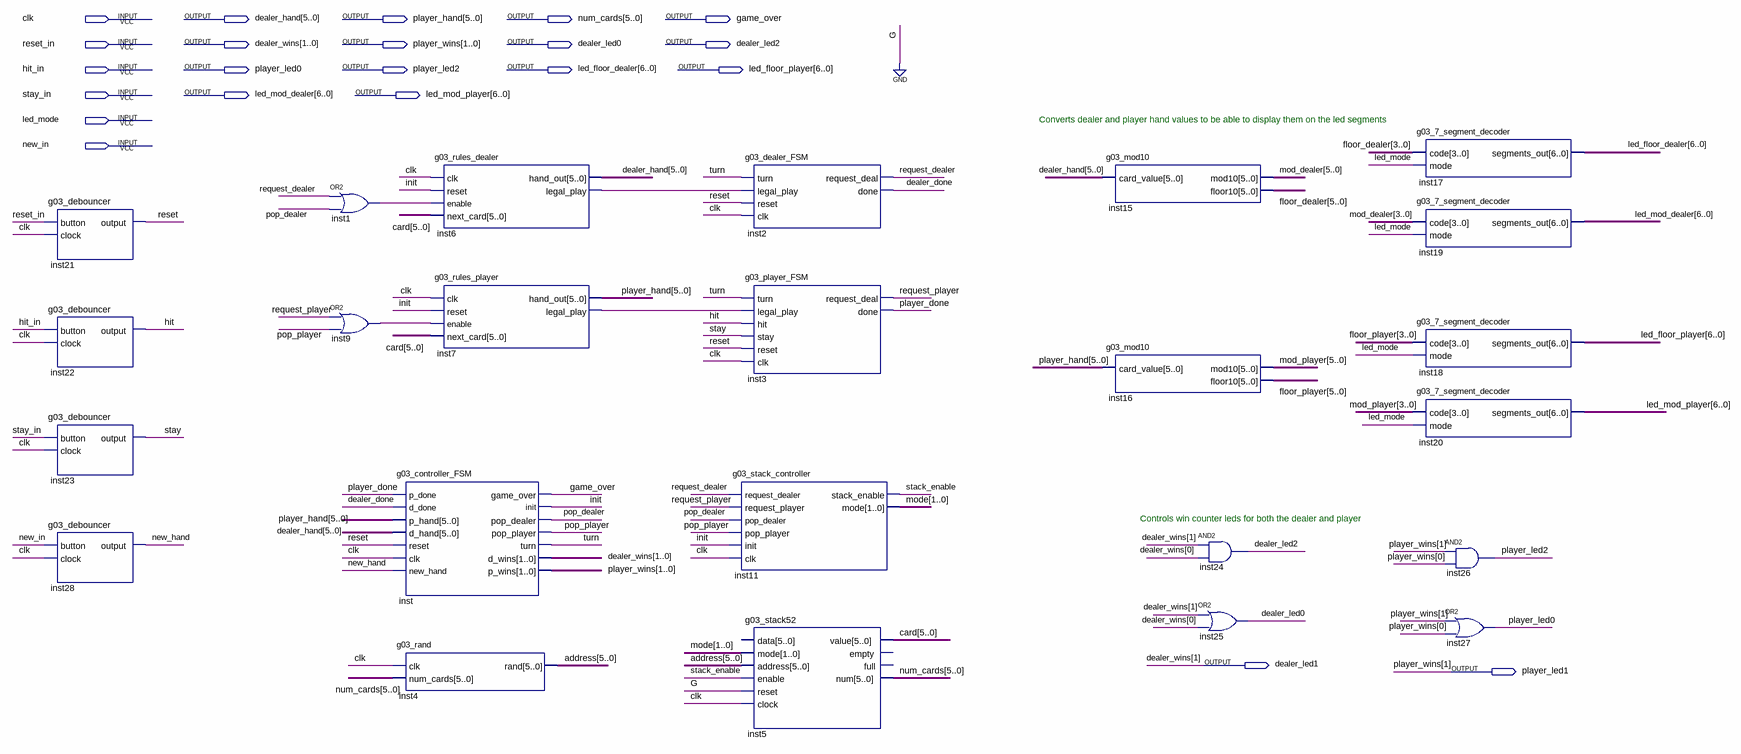
[diagram p0: schematic sheet]
// Quartus schematic g03_blackjack.bdf as structural Verilog: 24 symbols, 22 pins
module g03_blackjack (
  input  clk,
  input  reset_in,
  input  hit_in,
  input  stay_in,
  input  led_mode,
  input  new_in,
  output [5:0] dealer_hand,
  output [5:0] player_hand,
  output [5:0] num_cards,
  output game_over,
  output [1:0] dealer_wins,
  output [1:0] player_wins,
  output dealer_led0,
  output dealer_led2,
  output player_led0,
  output player_led2,
  output [6:0] led_floor_dealer,
  output [6:0] led_floor_player,
  output [6:0] led_mod_dealer,
  output [6:0] led_mod_player,
  output dealer_led1,
  output player_led1
);

  wire dealer_done, hit, init, inst1_out, inst6_legal_play, inst7_legal_play, inst9_out, new_hand,
       player_done, pop_dealer, pop_player, request_dealer, request_player, reset, stack_enable, stay, turn;
  wire [1:0] mode;
  wire [5:0] address, card, floor_dealer, floor_player, mod_dealer, mod_player;

  g03_debouncer inst21 (.button(reset_in), .clock(clk), .\output (reset));
  g03_debouncer inst22 (.button(hit_in), .clock(clk), .\output (hit));
  g03_debouncer inst23 (.button(stay_in), .clock(clk), .\output (stay));
  g03_debouncer inst28 (.button(new_in), .clock(clk), .\output (new_hand));
  or inst1 (inst1_out, request_dealer, pop_dealer);
  or inst9 (inst9_out, request_player, pop_player);
  g03_controller_FSM inst (
    .p_done(player_done), .d_done(dealer_done), .p_hand(player_hand), .d_hand(dealer_hand), .reset(reset),
    .clk(clk), .new_hand(new_hand), .game_over(game_over), .init(init), .pop_dealer(pop_dealer),
    .pop_player(pop_player), .turn(turn), .d_wins({dealer_led1, dealer_wins[0]}),
    .p_wins({player_led1, player_wins[0]}));
  g03_rand inst4 (.clk(clk), .num_cards(num_cards), .\rand (address));
  g03_rules_dealer inst6 (
    .clk(clk), .reset(init), .enable(inst1_out), .next_card(card), .hand_out(dealer_hand),
    .legal_play(inst6_legal_play));
  g03_rules_player inst7 (
    .clk(clk), .reset(init), .enable(inst9_out), .next_card(card), .hand_out(player_hand),
    .legal_play(inst7_legal_play));
  g03_stack_controller inst11 (
    .request_dealer(request_dealer), .request_player(request_player), .pop_dealer(pop_dealer),
    .pop_player(pop_player), .init(init), .clk(clk), .stack_enable(stack_enable), .mode(mode));
  g03_dealer_FSM inst2 (
    .turn(turn), .legal_play(inst6_legal_play), .reset(reset), .clk(clk), .request_deal(request_dealer),
    .done(dealer_done));
  g03_player_FSM inst3 (
    .turn(turn), .legal_play(inst7_legal_play), .hit(hit), .stay(stay), .reset(reset), .clk(clk),
    .request_deal(request_player), .done(player_done));
  g03_stack52 inst5 (
    .mode(mode), .address(address), .enable(stack_enable), .reset(1'b0), .clock(clk), .value(card),
    .num(num_cards));  // open: data, empty, full
  g03_mod10 inst15 (.card_value(dealer_hand), .mod10(mod_dealer), .floor10(floor_dealer));
  g03_mod10 inst16 (.card_value(player_hand), .mod10(mod_player), .floor10(floor_player));
  and inst24 (dealer_led2, dealer_led1, dealer_wins[0]);
  or inst25 (dealer_led0, dealer_led1, dealer_wins[0]);
  g03_7_segment_decoder inst17 (.code(floor_dealer[3:0]), .mode(led_mode), .segments_out(led_floor_dealer));
  g03_7_segment_decoder inst19 (.code(mod_dealer[3:0]), .mode(led_mode), .segments_out(led_mod_dealer));
  g03_7_segment_decoder inst18 (.code(floor_player[3:0]), .mode(led_mode), .segments_out(led_floor_player));
  g03_7_segment_decoder inst20 (.code(mod_player[3:0]), .mode(led_mode), .segments_out(led_mod_player));
  and inst26 (player_led2, player_led1, player_wins[0]);
  or inst27 (player_led0, player_led1, player_wins[0]);

  assign dealer_wins[1] = dealer_led1;
  assign player_wins[1] = player_led1;

  // Notes on the sheet:
  //   Converts dealer and player hand values to be able to display them on the led segments
  //   Controls win counter leds for both the dealer and player
endmodule
